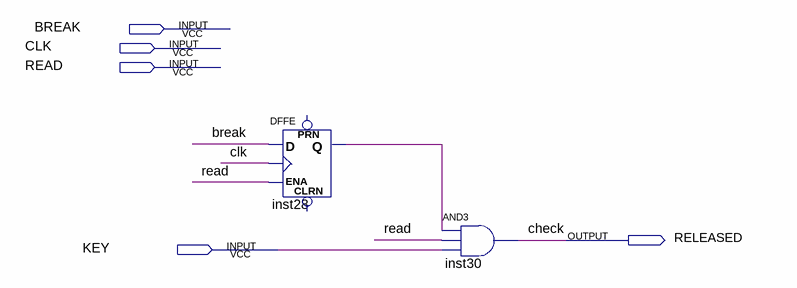
[diagram p0: schematic sheet]
// Quartus schematic KEY.bdf as structural Verilog: 2 symbols, 5 pins
module KEY (
  input  BREAK,
  input  CLK,
  input  READ,
  input  KEY,
  output RELEASED
);

  wire inst28_q;

  DFFE inst28 (.D(BREAK), .CLK(CLK), .ENA(READ), .Q(inst28_q));  // open: PRN, CLRN
  and inst30 (RELEASED, inst28_q, READ, KEY);

  // Other names for the same wires on the sheet: check = RELEASED
endmodule
